# Altium project precursor_pvt2.PrjPcb (part 3 of 3)
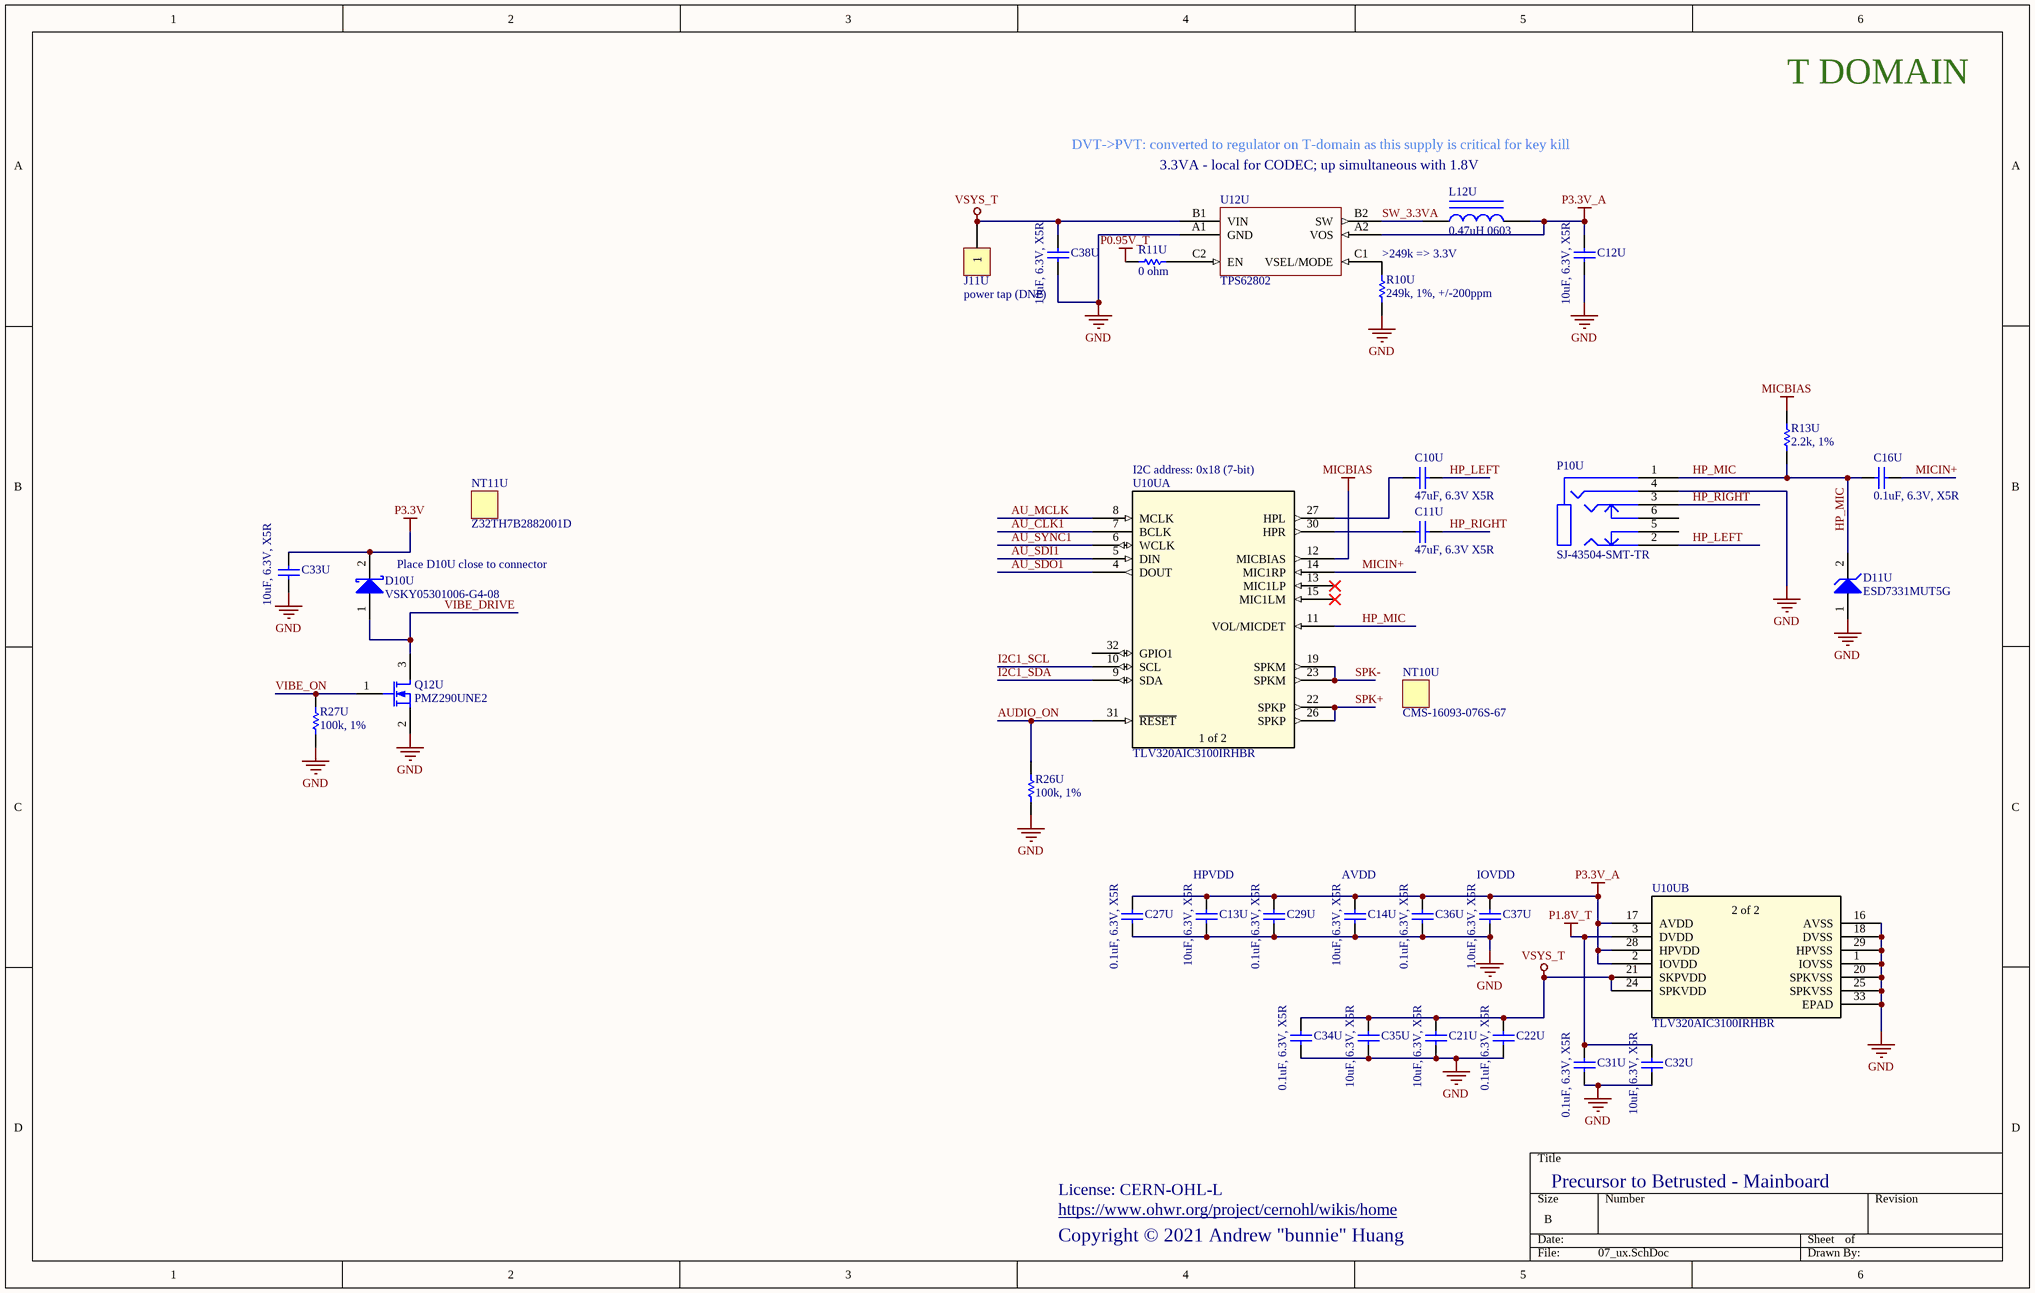
[diagram p9: 07_ux.SchDoc]

## Nets that join several sheets
GND: 01_fpga (165 pins), 02_memory (21 pins), 03_power (77 pins), 04_io (41 pins), 05_kbd_pm (39 pins), 06_rng (14 pins), 07_ux (29 pins)
P0.95V_T: 01_fpga (38 pins), 07_ux (R11U.1)
P1.2V: 03_power (R19P.1), 05_kbd_pm (9 pins)
P1.8V: 01_fpga (C37F.2 P11F.16 P12F.9), 03_power (10 pins), 04_io (19 pins), 05_kbd_pm (17 pins)
P1.8V_SBY: 01_fpga (5 pins), 02_memory (15 pins)
P1.8V_T: 01_fpga (53 pins), 02_memory (7 pins), 06_rng (C12R.2 C17R.2 U10R.6 U12R.6), 07_ux (C31U.1 C32U.1 U10U.3)
P3.3V: 01_fpga (P11F.20), 03_power (C24P.1 L12P.2 U13P.A2), 04_io (J10U.1 L13W.2), 05_kbd_pm (8 pins), 07_ux (C33U.2 D10U.2)
P3.3V_A: 01_fpga (23 pins), 03_power (R35P.2), 07_ux (12 pins)
P5.0V: 03_power (C28P.1 C29P.1 U15P.B2), 04_io (5 pins)
PACK_P: 01_fpga (P11F.4 P11F.5 P11F.6), 03_power (6 pins)
VBAT: 01_fpga (5 pins), 03_power (6 pins)
VBUS: 01_fpga (Q12F.1), 03_power (14 pins)
VBUS_SWITCHED: 01_fpga (C63F.1 P12F.12 P12F.13 P12F.14), 03_power (8 pins)
VSYS_RAW: 01_fpga (C36F.1 J10F.1 Q10F.4 R10F.2), 02_memory (C19M.1 J10M.1 R14M.1 U13M.B1), 03_power (10 pins)
VSYS_T: 01_fpga (10 pins), 06_rng (5 pins), 07_ux (9 pins)
VSYS_U: 01_fpga (P11F.9), 03_power (16 pins), 04_io (C27W.1 J10W.1 L14W.1 U12W.8), 05_kbd_pm (9 pins)
ALLOW_UP5K_N: 01_fpga (U11F.B14), 05_kbd_pm (6 pins)
AU_CLK1: 01_fpga (U11F.D12), 07_ux (U10U.7)
AU_MCLK: 01_fpga (U11F.E12), 07_ux (U10U.8)
AU_SDI1: 01_fpga (U11F.E13), 07_ux (U10U.5)
AU_SDO1: 01_fpga (U11F.C13), 07_ux (U10U.4)
AU_SYNC1: 01_fpga (U11F.D14), 07_ux (U10U.6)
AUDIO_ON: 01_fpga (U11F.B7), 07_ux (R26U.2 U10U.31)
BOOSTMODE: 01_fpga (U11F.H16), 03_power (Q16P.1 Q17P.1 R42P.2)
CC_ID: 01_fpga (U11F.D18), 03_power (R35P.1 U16P.9)
CC_INT_N: 03_power (R34P.1 U16P.6), 05_kbd_pm (U11K.42)
CHG_TS: 01_fpga (P11F.7), 03_power (5 pins)
COL0: 01_fpga (U11F.B13), 05_kbd_pm (U16K.9)
COL1: 01_fpga (U11F.C18), 05_kbd_pm (P10K.5)
COL2: 01_fpga (U11F.E14), 05_kbd_pm (P10K.10)
COL3: 01_fpga (U11F.D15), 05_kbd_pm (P10K.11)
COL4: 01_fpga (U11F.B18), 05_kbd_pm (P10K.4)
COL5: 01_fpga (U11F.D16), 05_kbd_pm (P10K.13)
COL6: 01_fpga (U11F.D17), 05_kbd_pm (P10K.6)
COL7: 01_fpga (U11F.F13), 05_kbd_pm (P10K.12)
COL8: 01_fpga (U11F.E15), 05_kbd_pm (P10K.14)
COL9: 01_fpga (U11F.A13), 05_kbd_pm (U16K.10)
COM_CIPO: 01_fpga (U11F.P16), 05_kbd_pm (U11K.10)
COM_COPI: 01_fpga (U11F.N18), 05_kbd_pm (U11K.9)
COM_CS: 01_fpga (U11F.T15), 05_kbd_pm (U11K.11)
COM_IRQ: 01_fpga (U11F.M16), 05_kbd_pm (U11K.6)
COM_SCLK: 01_fpga (U11F.R16), 05_kbd_pm (U11K.20)
CRESET_B: 01_fpga (P12F.4 Q18F.3), 03_power (R22P.1 U14P.1), 05_kbd_pm (U11K.8)
EC_HOLD: 01_fpga (U11F.L13), 05_kbd_pm (U11K.12)
EXTCOMMIN: 04_io (P12W.7), 05_kbd_pm (U11K.45)
FPGA_DIS: 01_fpga (Q14F.1 Q15F.1 R23F.2), 05_kbd_pm (U11K.21)
GG_INT: 03_power (R18P.2 U11P.A1 U17P.F4), 05_kbd_pm (P10K.26 R23K.1)
GPIO3: 01_fpga (P11F.14 U11F.G15), 05_kbd_pm (P10K.30)
GPIO4: 01_fpga (P11F.13 U11F.H15), 05_kbd_pm (P10K.29)
GYRO_INT0: 04_io (U14W.4), 05_kbd_pm (U11K.43)
I2C0_SCL: 01_fpga (P11F.18), 03_power (U11P.A3 U16P.8 U17P.F5), 04_io (U12W.10 U14W.13), 05_kbd_pm (P10K.27 R19K.1 U11K.23)
I2C0_SDA: 01_fpga (P11F.17), 03_power (U11P.A2 U16P.7 U17P.E4), 04_io (U12W.9 U14W.14), 05_kbd_pm (P10K.28 R18K.1 U11K.25)
I2C1_SCL: 01_fpga (R26F.1 U11F.G2 U18F.3), 07_ux (U10U.10)
I2C1_SDA: 01_fpga (R25F.1 U11F.F2 U18F.4), 07_ux (U10U.9)
KEY0: 01_fpga (U11F.A15), 05_kbd_pm (P10K.16)
KEY1: 01_fpga (U11F.A17), 05_kbd_pm (P10K.1)
KEY2: 01_fpga (U11F.A16), 05_kbd_pm (P10K.18)
KEY3: 01_fpga (U11F.A14), 05_kbd_pm (U16K.2)
KEY4: 01_fpga (U11F.C17), 05_kbd_pm (P10K.2)
KEY5: 01_fpga (U11F.B16), 05_kbd_pm (P10K.17)
KEY6: 01_fpga (U11F.B17), 05_kbd_pm (P10K.19)
KEY7: 01_fpga (U11F.C14), 05_kbd_pm (P10K.25)
KEY8: 01_fpga (U11F.B15), 05_kbd_pm (U16K.4)
LCD_DISP: 04_io (C28W.1 P12W.6), 05_kbd_pm (U11K.44)
LCD_SCLK: 01_fpga (U11F.H17), 04_io (P12W.10)
LCD_SCS: 01_fpga (U11F.G17), 04_io (P12W.8 R14W.2)
LCD_SI: 01_fpga (U11F.H18), 04_io (P12W.9)
NOISE0: 01_fpga (U11F.C5), 06_rng (J12R.1 R15R.1 U12R.4)
NOISE1: 01_fpga (U11F.A8), 06_rng (J11R.1 R10R.1 U10R.4)
NOISE_ON0: 01_fpga (U11F.P14), 06_rng (R17R.2 U12R.5)
NOISE_ON1: 01_fpga (U11F.R13), 06_rng (R12R.2 U10R.5)
NOISEBIAS_ON: 01_fpga (U11F.H14), 06_rng (U11R.1)
PROG_B: 01_fpga (P12F.21 R24F.1 U11F.R8 U14F.1), 02_memory (U12M.A4), 05_kbd_pm (C25K.1 SW10K.5)
PWR_S0_REPLICA: 01_fpga (U11F.U7), 05_kbd_pm (R15K.2 U11K.19)
SPINOR_CIPO: 01_fpga (U11F.K18), 02_memory (J17M.1 U12M.D2)
SPINOR_COPI: 01_fpga (U11F.K17), 02_memory (J12M.1 U12M.D3)
SPINOR_CSN: 01_fpga (U11F.M13), 02_memory (R13M.1 U12M.C2)
SPINOR_DQS: 01_fpga (U11F.R14), 02_memory (U12M.C3)
SPINOR_ECSN: 01_fpga (R30F.2 U11F.L16), 02_memory (U12M.A5)
SPINOR_IO2: 01_fpga (U11F.L14), 02_memory (U12M.C4)
SPINOR_IO3: 01_fpga (U11F.M15), 02_memory (U12M.D4)
SPINOR_IO4: 01_fpga (U11F.L17), 02_memory (U12M.D5)
SPINOR_IO5: 01_fpga (U11F.L18), 02_memory (U12M.E3)
SPINOR_IO6: 01_fpga (U11F.M14), 02_memory (U12M.E2)
SPINOR_IO7: 01_fpga (U11F.N14), 02_memory (U12M.E1)
SPINOR_SCK: 01_fpga (U11F.C8 U11F.C12), 02_memory (J11M.1 U12M.B2)
SPK+: 01_fpga (P11F.25), 07_ux (U10U.22 U10U.26)
SPK-: 01_fpga (P11F.26), 07_ux (U10U.19 U10U.23)
SRAM_A0: 01_fpga (U11F.V12), 02_memory (J13M.1 U10M.A3 U11M.A3)
SRAM_A1: 01_fpga (U11F.M5), 02_memory (U10M.A4 U11M.A4)
SRAM_A2: 01_fpga (U11F.P5), 02_memory (U10M.A5 U11M.A5)
SRAM_A3: 01_fpga (U11F.N4), 02_memory (U10M.B3 U11M.B3)
SRAM_A4: 01_fpga (U11F.V14), 02_memory (U10M.B4 U11M.B4)
SRAM_A5: 01_fpga (U11F.M3), 02_memory (U10M.C3 U11M.C3)
SRAM_A6: 01_fpga (U11F.R17), 02_memory (U10M.C4 U11M.C4)
SRAM_A7: 01_fpga (U11F.U15), 02_memory (U10M.D4 U11M.D4)
SRAM_A8: 01_fpga (U11F.M4), 02_memory (U10M.H5 U11M.H2)
SRAM_A9: 01_fpga (U11F.L6), 02_memory (U10M.H4 U11M.H3)
SRAM_A10: 01_fpga (U11F.K3), 02_memory (U10M.H3 U11M.H4)
SRAM_A11: 01_fpga (U11F.R18), 02_memory (U10M.H2 U11M.H5)
SRAM_A12: 01_fpga (U11F.U16), 02_memory (U10M.G3 U11M.G3)
SRAM_A13: 01_fpga (U11F.K1), 02_memory (U10M.G2 U11M.G4)
SRAM_A14: 01_fpga (U11F.R5), 02_memory (U10M.F4 U11M.F3)
SRAM_A15: 01_fpga (U11F.T2), 02_memory (U10M.F3 U11M.F4)
SRAM_A16: 01_fpga (U11F.U1), 02_memory (U10M.E3 U11M.E4)
SRAM_A17: 01_fpga (U11F.N1), 02_memory (U10M.D3 U11M.D3)
SRAM_A18: 01_fpga (U11F.L5), 02_memory (U10M.H6 U11M.H1)
SRAM_A19: 01_fpga (U11F.K2), 02_memory (U10M.G4 U11M.G2)
SRAM_A20: 01_fpga (U11F.M18), 02_memory (U10M.H1 U11M.H6)
SRAM_A21: 01_fpga (U11F.T6), 02_memory (U10M.E4 U11M.E3)
SRAM_CE_N_1.8: 01_fpga (U16F.B1), 02_memory (R11M.2 U10M.B5 U11M.B5)
SRAM_D0: 01_fpga (U11F.M2), 02_memory (U10M.B6)
SRAM_D1: 01_fpga (U11F.R4), 02_memory (U10M.C5)
SRAM_D2: 01_fpga (U11F.P2), 02_memory (U10M.C6)
SRAM_D3: 01_fpga (U11F.L4), 02_memory (U10M.D5)
SRAM_D4: 01_fpga (U11F.L1), 02_memory (U10M.E5)
SRAM_D5: 01_fpga (U11F.M1), 02_memory (U10M.F5)
SRAM_D6: 01_fpga (U11F.R1), 02_memory (U10M.F6)
SRAM_D7: 01_fpga (U11F.P1), 02_memory (U10M.G6)
SRAM_D8: 01_fpga (U11F.U3), 02_memory (J14M.1 U10M.B1)
SRAM_D9: 01_fpga (U11F.V2), 02_memory (U10M.C1)
SRAM_D10: 01_fpga (U11F.V4), 02_memory (U10M.C2)
SRAM_D11: 01_fpga (U11F.U2), 02_memory (U10M.D2)
SRAM_D12: 01_fpga (U11F.N2), 02_memory (U10M.E2)
SRAM_D13: 01_fpga (U11F.T1), 02_memory (U10M.F2)
SRAM_D14: 01_fpga (U11F.K6), 02_memory (U10M.F1)
SRAM_D15: 01_fpga (U11F.J6), 02_memory (U10M.G1)
SRAM_D16: 01_fpga (U11F.V16), 02_memory (U11M.B6)
SRAM_D17: 01_fpga (U11F.V15), 02_memory (U11M.C5)
SRAM_D18: 01_fpga (U11F.U17), 02_memory (U11M.C6)
SRAM_D19: 01_fpga (U11F.U18), 02_memory (U11M.D5)
SRAM_D20: 01_fpga (U11F.P17), 02_memory (U11M.E5)
SRAM_D21: 01_fpga (U11F.T18), 02_memory (U11M.F5)
SRAM_D22: 01_fpga (U11F.P18), 02_memory (U11M.F6)
SRAM_D23: 01_fpga (U11F.M17), 02_memory (U11M.G6)
SRAM_D24: 01_fpga (U11F.N3), 02_memory (U11M.B1)
SRAM_D25: 01_fpga (U11F.T4), 02_memory (U11M.C1)
SRAM_D26: 01_fpga (U11F.V13), 02_memory (U11M.C2)
SRAM_D27: 01_fpga (U11F.P15), 02_memory (U11M.D2)
SRAM_D28: 01_fpga (U11F.T14), 02_memory (U11M.E2)
SRAM_D29: 01_fpga (U11F.R15), 02_memory (U11M.F2)
SRAM_D30: 01_fpga (U11F.T3), 02_memory (U11M.F1)
SRAM_D31: 01_fpga (U11F.R7), 02_memory (U11M.G1)
SRAM_DM0: 01_fpga (U11F.V3), 02_memory (U10M.A1)
SRAM_DM1: 01_fpga (U11F.R2), 02_memory (U10M.B2)
SRAM_DM2: 01_fpga (U11F.T5), 02_memory (U11M.A1)
SRAM_DM3: 01_fpga (U11F.T13), 02_memory (U11M.B2)
SRAM_OE_N: 01_fpga (U11F.U12), 02_memory (J16M.1 U10M.A2 U11M.A2)
SRAM_WE_N: 01_fpga (U11F.K4), 02_memory (J15M.1 U10M.G5 U11M.G5)
SRAM_ZZ_N_1.8: 01_fpga (U17F.B1), 02_memory (R10M.2 R12M.1 U10M.A6 U11M.A6)
SYS_ON: 03_power (Q12P.1 R26P.2), 05_kbd_pm (U11K.47)
T_TO_U_ON: 01_fpga (U11F.G18), 03_power (Q13P.1 R29P.1)
U_TO_T_ON: 01_fpga (Q13F.1 R28F.2), 05_kbd_pm (U11K.46)
UP5K_CIPO: 01_fpga (P12F.7), 05_kbd_pm (U10K.2 U11K.17)
UP5K_COPI: 01_fpga (P12F.6), 05_kbd_pm (U10K.5 U11K.14)
UP5K_CSN: 01_fpga (P12F.5), 05_kbd_pm (R11K.2 U10K.1 U11K.16)
UP5K_KEYCOL0: 01_fpga (P12F.19), 05_kbd_pm (U11K.48 U12K.9)
UP5K_KEYCOL1: 01_fpga (P12F.20), 05_kbd_pm (U11K.3 U12K.10)
UP5K_SCK: 01_fpga (P12F.8), 05_kbd_pm (R21K.2 U10K.6 U11K.15)
USB_N: 01_fpga (U11F.A3 U11F.B1), 03_power (R31P.2)
USB_P: 01_fpga (U11F.C1 U11F.C3), 03_power (R32P.2)
USBDN_PD: 01_fpga (U11F.A4), 03_power (R12P.2)
USBDN_PU: 01_fpga (U11F.B2), 03_power (R15P.2)
USBDP_PD: 01_fpga (U11F.C2), 03_power (R33P.2)
USBDP_PU: 01_fpga (U11F.D1), 03_power (R30P.2)
VBUS_DIV: 01_fpga (U11F.C4), 03_power (R27P.1 R28P.1)
VIBE_DRIVE: 01_fpga (P11F.19), 07_ux (D10U.1 Q12U.3)
VIBE_ON: 01_fpga (U11F.G13), 07_ux (Q12U.1 R27U.2)
WIFI_CIPO: 04_io (U10W.28), 05_kbd_pm (U11K.27)
WIFI_COPI: 04_io (U10W.27), 05_kbd_pm (U11K.28)
WIFI_CS: 04_io (U10W.31), 05_kbd_pm (U11K.32)
WIFI_LPCLK: 01_fpga (U11F.N15), 04_io (U10W.23 U11W.2), 05_kbd_pm (R24K.1)
WIFI_PA_ENABLE: 04_io (U10W.4), 05_kbd_pm (U11K.34)
WIFI_RES_N: 04_io (R10W.2 U10W.15), 05_kbd_pm (U11K.36)
WIFI_SCLK: 04_io (U10W.26), 05_kbd_pm (U11K.26)
WIFI_WIRQ: 04_io (U10W.29), 05_kbd_pm (U11K.31)
WIFI_WUP: 04_io (U10W.16), 05_kbd_pm (U11K.38)